# EAGLE design LAMPU_EMERGENCY_v1.1 (EAGLE 9.6.1)
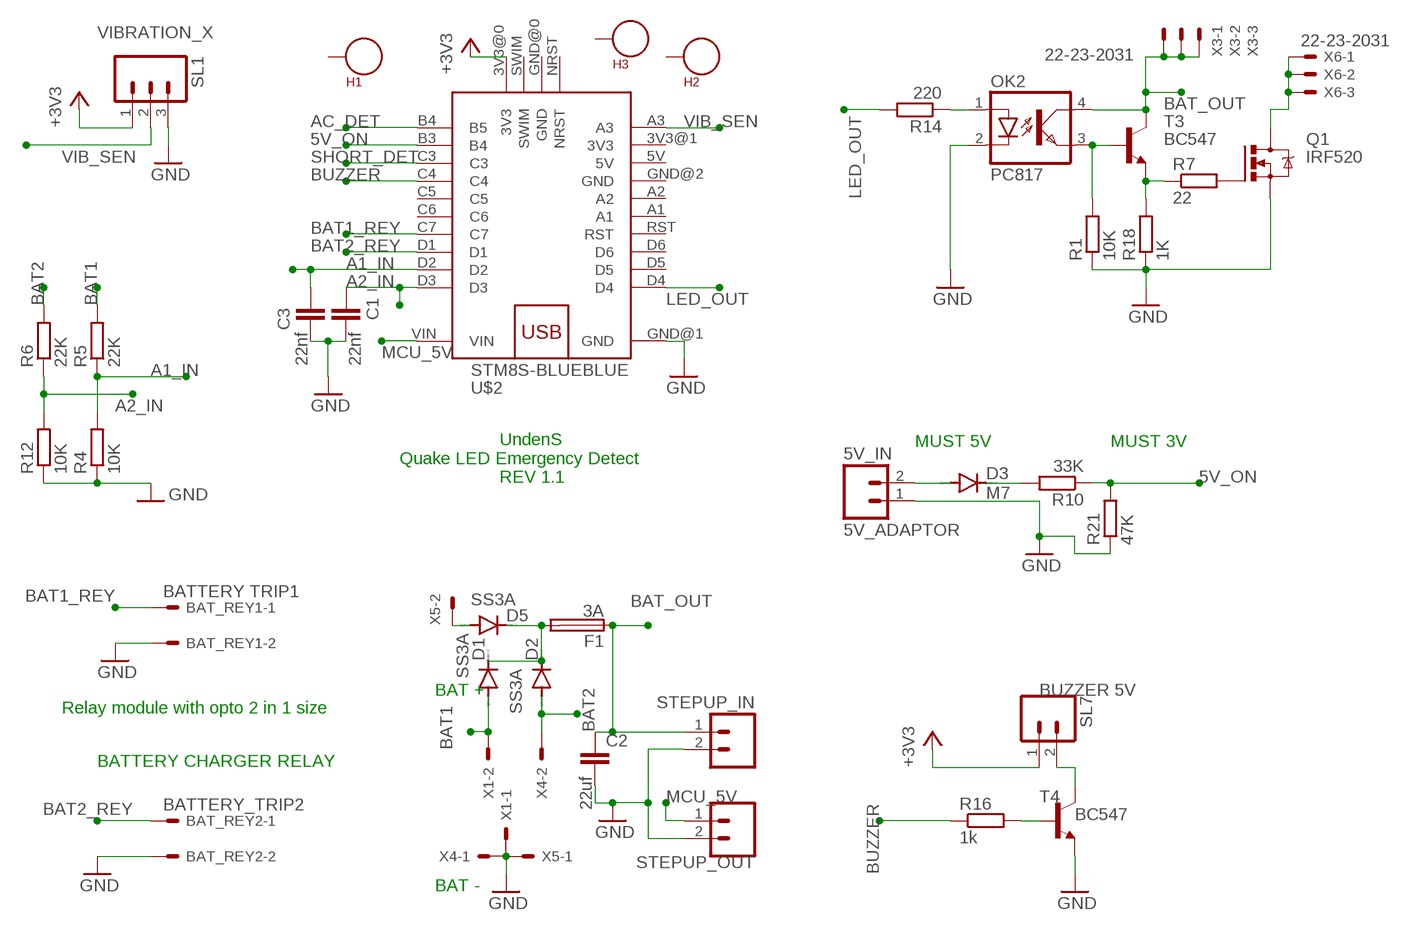
[diagram p0: schematic, sheet 1]

## Parts
5V_IN  5V_ADAPTOR  M02  [02P]
BAT_REY1  BATTERY TRIP1  22-23-2021  [22-23-2021]
BAT_REY2  BATTERY_TRIP2  22-23-2021  [22-23-2021]
C1  22nf  C-EUC0805K  [C0805K]
C2  22uf  C-EUC0805K  [C0805K]
C3  22nf  C-EUC0805K  [C0805K]
D1  SS3A  ES2D  [SMB]
D2  SS3A  ES2D  [SMB]
D3  M7  ES2D  [SMB]
D5  SS3A  ES2D  [SMB]
F1  3A  FUSEGSH15  [GSH15]
H1  SEW_HOLE  [SIMPLE_HOLE]
H2  SEW_HOLE  [SIMPLE_HOLE]
H3  SEW_HOLE  [SIMPLE_HOLE]
OK2  PC817  [DIL04]
Q1  IRF520  [TO220BV]
R1  10K  R-EU_0207/7  [0207/7]
R4  10K  R-EU_0207/7  [0207/7]
R5  22K  R-EU_0207/7  [0207/7]
R6  22K  R-EU_0207/7  [0207/7]
R7  22  R-EU_0207/7  [0207/7]
R10  33K  R-EU_0207/7  [0207/7]
R12  10K  R-EU_0207/7  [0207/7]
R14  220  R-EU_0207/7  [0207/7]
R16  1k  R-EU_0207/7  [0207/7]
R18  1K  R-EU_0207/7  [0207/7]
R21  47K  R-EU_0207/7  [0207/7]
SL1  VIBRATION_X  M03  [03P]
SL7  BUZZER 5V  M02  [02P]
STEP_IN  STEPUP_IN  M02  [02P]
STEP_MCU  STEPUP_OUT  M02  [02P]
T3  BC547  [TO92]
T4  BC547  [TO92]
U$2  STM8S-BLUEBLUE  [WEMOS-D1-MINI]
X1  22-23-2021  [22-23-2021]
X3  22-23-2031  [22-23-2031]
X4  22-23-2021  [22-23-2021]
X5  22-23-2021  [22-23-2021]
X6  22-23-2031  [22-23-2031]

## Nets
5V_ON: R10.1 R21.2 U$2.B3(B4)
+3V3: SL1.1 SL7.1 U$2.3V3@0(3V3)
A1_IN: C3.1 R4.2 R5.1 U$2.D2
A2_IN: C1.1 R6.1 R12.2 U$2.D3
AC_DET: U$2.B4(B5)
BAT1: D1.A R5.2 X1.2
BAT1_REY: BAT_REY1.1 U$2.C7
BAT2: D2.A R6.2 X4.2
BAT2_REY: BAT_REY2.1 U$2.D1
BAT_OUT: C2.1 F1.1 OK2.4(COL) STEP_IN.1 T3.3(C) X3.1 X3.2 X3.3
BUZZER: R16.1 U$2.C4
GND: 5V_IN.1 BAT_REY1.2 BAT_REY2.2 C1.2 C2.2 C3.2 OK2.2(C) Q1.S R1.1 R4.1 R12.1 R18.1 R21.1 SL1.3 STEP_IN.2 STEP_MCU.2 T4.1(E) U$2.GND@1(GND) X1.1 X4.1 X5.1
LED_OUT: R14.2 U$2.D4
MCU_5V: STEP_MCU.1 U$2.VIN
N$1: OK2.3(EMIT) R1.2 T3.2(B)
N$14: 5V_IN.2 D3.A
N$15: SL7.2 T4.3(C)
N$17: D1.C D2.C D5.C F1.2
N$18: R16.2 T4.2(B)
N$21: R7.1 R18.2 T3.1(E)
N$22: Q1.G R7.2
N$23: OK2.1(A) R14.1
N$24: Q1.D X6.1 X6.2 X6.3
N$25: D3.C R10.2
N$28: D5.A X5.2
SHORT_DET: U$2.C3
VIB_SEN: SL1.2 U$2.A3
Unconnected: H1.P$1 H2.P$1 H3.P$1 U$2.A1 U$2.A2 U$2.C5 U$2.C6 U$2.D5 U$2.D6 U$2.GND@0(GND) U$2.NRST U$2.RST U$2.SWIM

## Notes on the sheet
- MUST 5V | MUST 3V
- UndenS
  Quake LED Emergency Detect
                      REV 1.1
- BAT +
- Relay module with opto 2 in 1 size
- BATTERY CHARGER RELAY
- BAT -

## Power pins joined to a net without a drawn wire
3V3: U$2.3V3@1(3V3)
5V: U$2.5V
GND: U$2.GND@2(GND)

## Library data of the parts
5V_IN SL7 STEP_IN STEP_MCU = con-amp-quick:M02: AMP QUICK CONNECTOR; OC_FARNELL: unknown; OC_NEWARK: unknown
BAT_REY1 BAT_REY2 X1 X4 X5 = con-molex:22-23-2021: .100" (2.54mm) Center Header - 2 Pin; MF: MOLEX; MPN: 22-23-2021; OC_FARNELL: 1462926; OC_NEWARK: 25C3832
C1-C3 = rcl:C-EU: CAPACITOR, European symbol; SPICEPREFIX: C
D1-D3 D5 = diode:ES2D: DIODE super fast rectifier, 2 A
F1 = fuse:FUSE: Fuse; OC_FARNELL: unknown; OC_NEWARK: unknown
H1-H3 = LilyPad-Wearables:SEW_HOLE: Simple sew-hole .1" diameter hole with 20mil annular ring
OK2 = optocoupler:PC817: SHARP OPTO COUPLER; MPN: PC817X4J000F; OC_FARNELL: 9707727; OC_NEWARK: 97K7059; SPICEPREFIX: O
Q1 = transistor-power:IRF520: HEXFET Power MOSFET; SPICEPREFIX: Q
R1 R4-R7 R10 R12 R14 R16 R18 R21 = rcl:R-EU_: RESISTOR, European symbol; SPICEPREFIX: R
SL1 = con-amp-quick:M03: AMP QUICK CONNECTOR; OC_FARNELL: unknown; OC_NEWARK: unknown
T3 T4 = transistor:BC547: NPN TRANSISTOR; SPICEPREFIX: J
U$2 = STM8-blue:STM8S-BLUE
X3 X6 = con-molex:22-23-2031: .100" (2.54mm) Center Header - 3 Pin; MF: MOLEX; MPN: 22-23-2031; OC_FARNELL: 1462950; OC_NEWARK: 30C0862

## Board
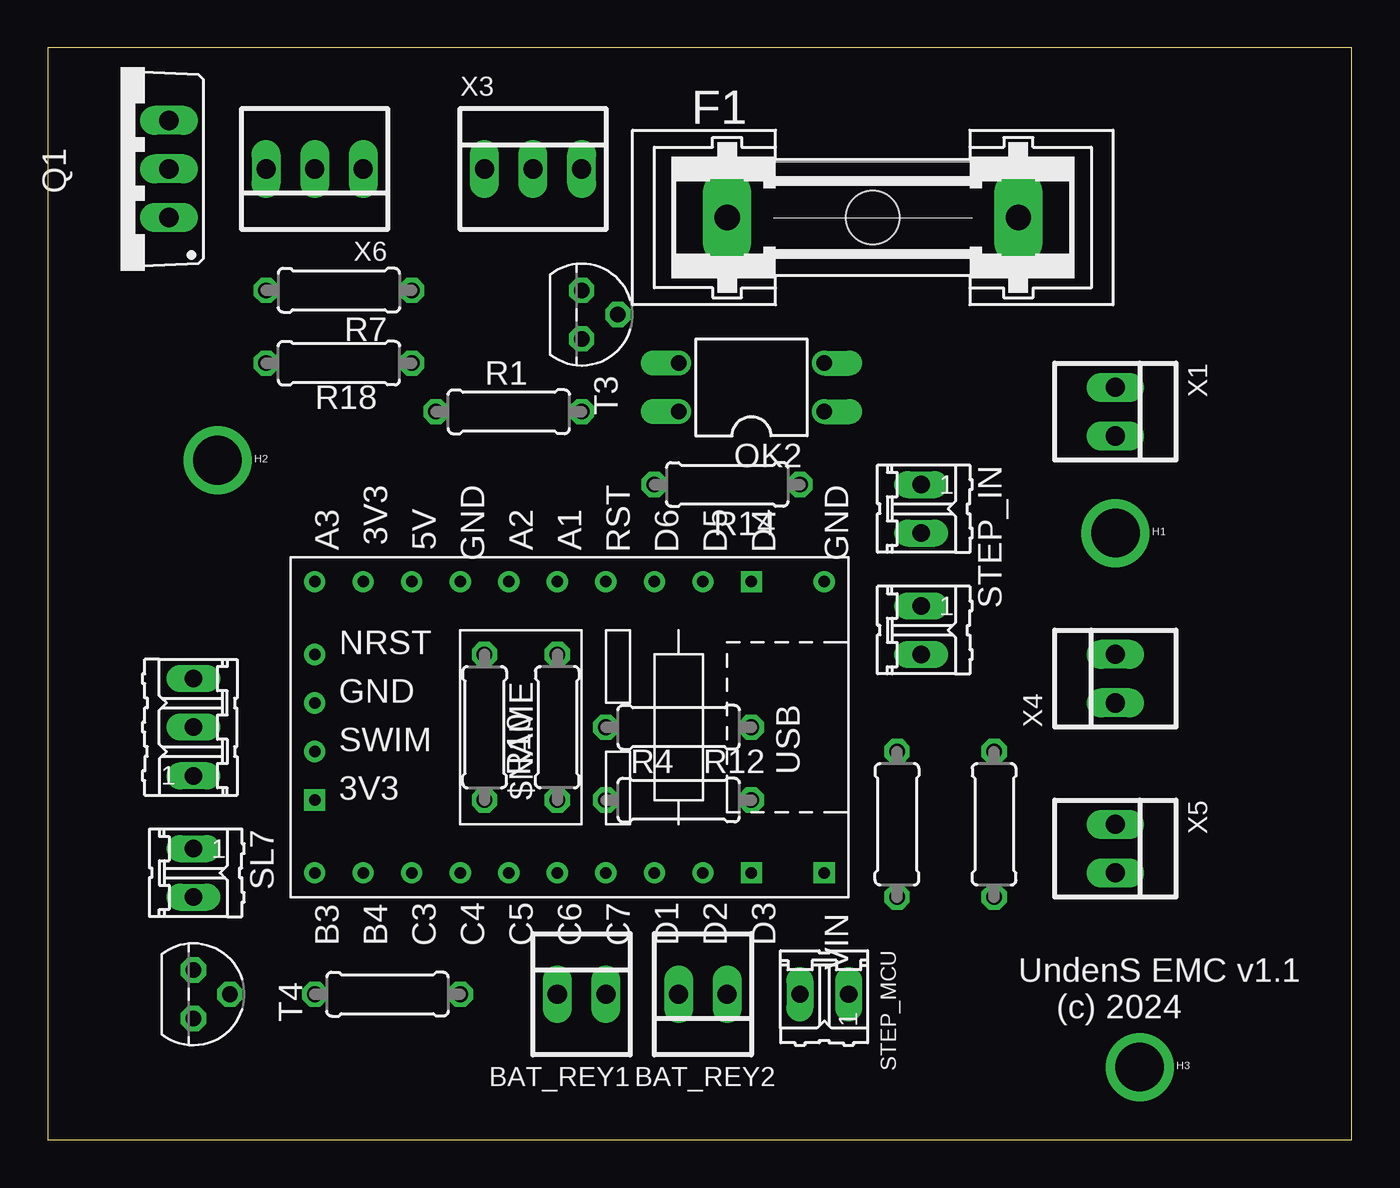
[diagram p1: board, top side]
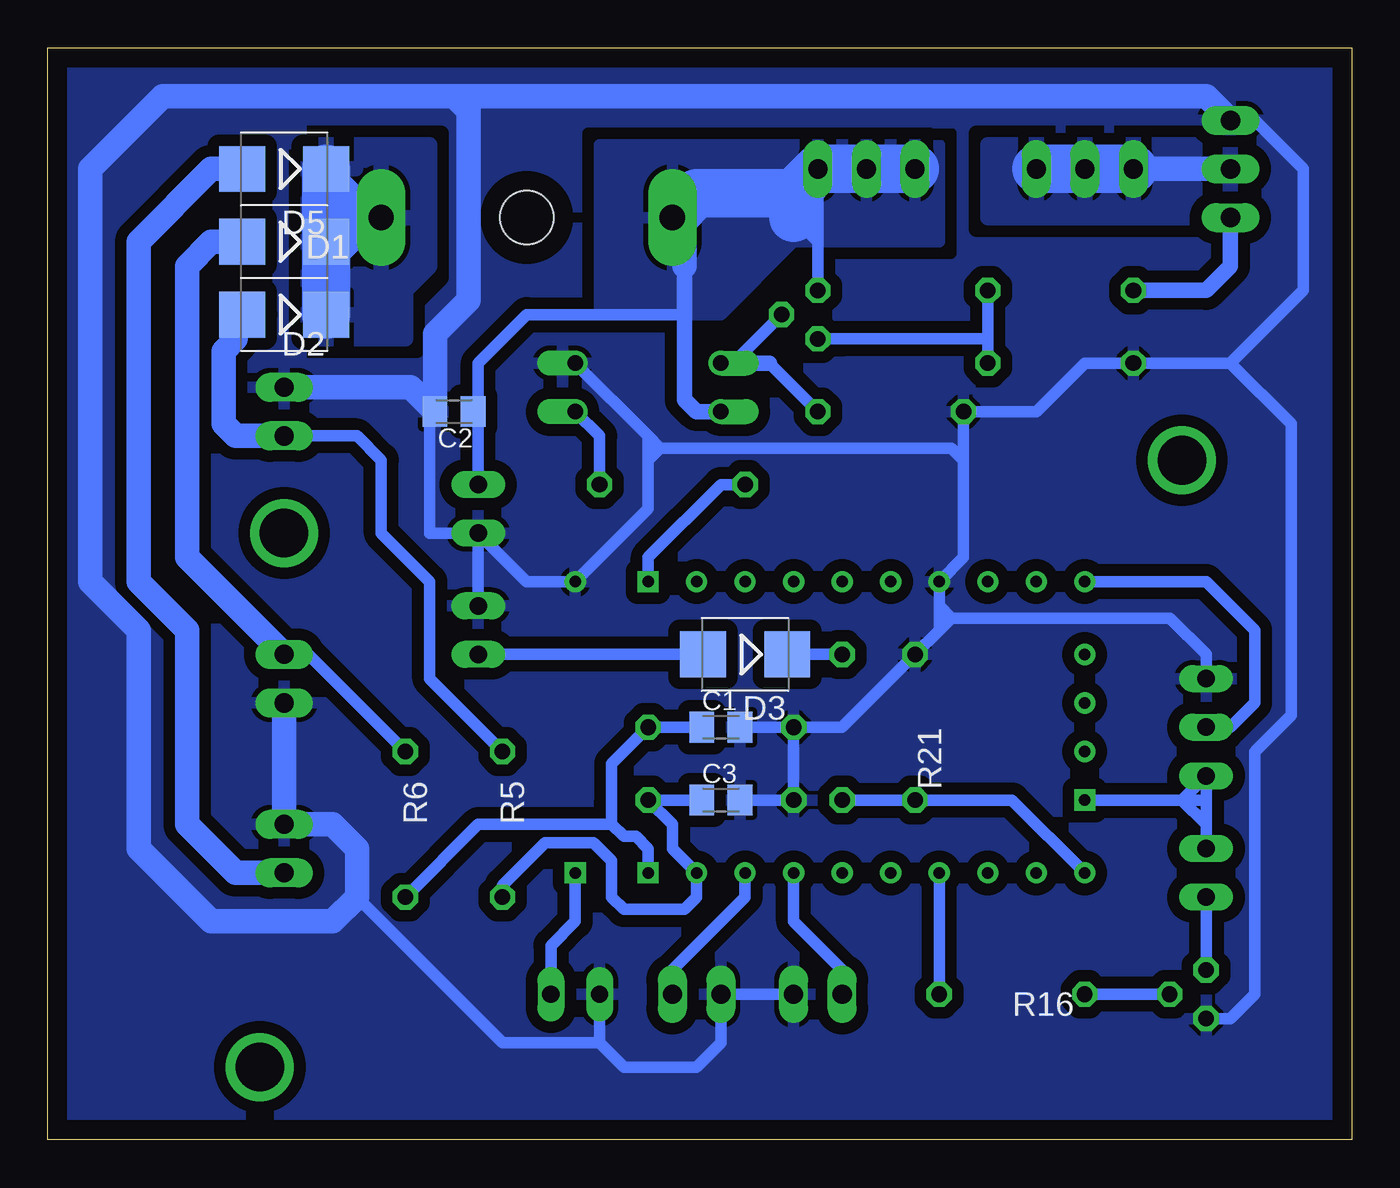
[diagram p2: board, bottom side, seen from below]

Size 68.25 x 57.14 mm. Coordinates in mm from the lower left corner, seen from the top.
Outline: 0,0 68.25,0 68.25,57.14 0,57.14 0,0
Copper layers (1*16): Top 0.035mm / dielectric 1.5mm / Bottom 0.035mm
Design rules "default": minimum track width 6mil, minimum drill 0.35mm, track to track 6mil, track to pad 6mil, pad to pad 6mil, via to via 6mil, smd to smd 6mil, copper to edge 40mil, drill to drill 6mil, minimum pad ring 10mil, minimum via ring 8mil, stop-mask expansion 4mil, vias tented up to drill 0mil, thermal gap 10mil

### Footprints (pad centres in the part's own frame; a part is rotated, then mirrored left to right if it is on the bottom)
02P = drill 0.914 long: 1 -1.27,0; 2 1.27,0
22-23-2021 = drill 1 long: 1 -1.27,0; 2 1.27,0
C0805K = smd 1.3 x 1.6: 1 -1,0; 2 1,0
SMB = smd 2.4 x 2.4: A 2.2,0; C -2.2,0
GSH15 = drill 1.321 pad 2.54 long: 1 -7.62,0; 2 7.62,0 | hole 2.794: 0,0
SIMPLE_HOLE = drill 2.54 pad 3.048: P$1 0,0
DIL04 = drill 0.813 offset: 1 -1.27,-3.81; 2 1.27,-3.81; 3 1.27,3.81; 4 -1.27,3.81
TO220BV = drill 1.016 long: D 0,-2.54; G -2.54,-2.54; S 2.54,-2.54
0207/7 = drill 0.813 octagon: 1 -3.81,0; 2 3.81,0
03P = drill 0.914 long: 1 -2.54,0; 2 0,0; 3 2.54,0
TO92 = drill 0.813 octagon: 1 1.27,0; 2 0,1.905; 3 -1.27,0
WEMOS-D1-MINI = drill 0.6 square: 3V3@0 -3.81,11.43; D3 -7.62,-11.43; D4 7.62,-11.43; VIN -7.62,-15.24 | drill 0.6: 3V3@1 7.62,8.89; 5V 7.62,6.35; A1 7.62,-1.27; A2 7.62,1.27; A3 7.62,11.43; B3 -7.62,11.43; B4 -7.62,8.89; C3 -7.62,6.35; C4 -7.62,3.81; C5 -7.62,1.27; C6 -7.62,-1.27; C7 -7.62,-3.81; D1 -7.62,-6.35; D2 -7.62,-8.89; D5 7.62,-8.89; D6 7.62,-6.35; GND@0 1.27,11.43; GND@1 7.62,3.81; GND@2 7.62,-15.24; NRST 3.81,11.43; RST 7.62,-3.81; SWIM -1.27,11.43
22-23-2031 = drill 1 long: 1 -2.54,0; 2 0,0; 3 2.54,0

### Placement (x,y rotation side)
5V_IN  45.72,26.67 270 top
BAT_REY1  27.94,7.62 0 top
BAT_REY2  34.29,7.62 180 top
C1  33.02,21.59 0 bottom
C2  46.99,38.1 180 bottom
C3  33.02,17.78 0 bottom
D1  55.88,43.18 180 bottom
D2  55.88,46.99 180 bottom
D3  31.75,25.4 180 bottom
D5  55.88,50.8 180 bottom
F1  43.18,48.26 0 top
H1  55.88,31.75 0 top
H2  8.89,35.56 0 top
H3  57.15,3.81 0 top
OK2  36.83,39.37 90 top
Q1  3.81,50.8 90 top
R1  24.13,38.1 0 top
R4  33.02,17.78 0 top
R5  44.45,16.51 90 top
R6  49.53,16.51 90 top
R7  15.24,44.45 180 top
R10  26.67,21.59 90 top
R12  33.02,21.59 0 top
R14  35.56,34.29 180 top
R16  17.78,7.62 180 top
R18  15.24,40.64 0 top
R21  22.86,21.59 270 top
SL1  7.62,21.59 90 top
SL7  7.62,13.97 270 top
STEP_IN  45.72,33.02 270 top
STEP_MCU  40.64,7.62 180 top
T3  27.94,43.18 270 top
T4  7.62,7.62 270 top
U$2  25.4,21.59 90 top
X1  55.88,38.1 270 top
X3  25.4,50.8 0 top
X4  55.88,24.13 90 top
X5  55.88,15.24 270 top
X6  13.97,50.8 180 top

### Tracks (layer width: path | path; a pad name or v marks a point on that pad's centre or on a via)
5V_ON
  Bottom 0.61: R10.1 R21.2 17.78,17.78 U$2.B3
+3V3
  Bottom 0.61: U$2.3V3@0 8.89,17.78 | 8.89,17.78 SL1.1 7.62,17.78 | 7.62,17.78 7.62,16.51 | 7.62,16.51 SL7.1 | 7.62,17.78 8.89,17.78 | 7.62,16.51 8.89,17.78
A1_IN
  Bottom 0.61: 34.29,17.51 C3.1 R4.2 35.56,16.51 35.56,15.24 U$2.D2 34.29,12.7 34.92,12.07 35.56,12.07 38.1,12.07 38.73,12.7 38.73,14.61 39.69,15.56 42.23,15.56 44.45,13.34 R5.1
A2_IN
  Bottom 0.61: C1.1 R12.2 38.73,19.68 38.73,17.78 38.73,16.51 | U$2.D3 36.83,15.24 37.47,15.88 38.1,15.88 38.73,16.51 | R6.1 45.72,16.51 38.73,16.51
BAT1
  Bottom 0.61: 58.42,43.18 D1.A | 57.15,43.18 D1.A | D1.A 58.25,43.01 | R5.2 48.26,24.13 48.26,29.21 50.8,31.75 50.8,35.56 52.07,36.83 X1.2
  Bottom 1.27: 58.59,43.01 58.25,43.01 | D1.A 58.42,42.84 58.42,41.91 59.05,41.28 59.05,37.47 58.42,36.83 X1.2
BAT1_REY
  Bottom 0.61: BAT_REY1.1 26.67,8.89 29.21,11.43 U$2.C7
BAT2
  Bottom 0.61: R6.2 54.61,25.4 X4.2
  Bottom 1.27: X4.2 60.96,30.48 60.96,45.72 59.69,46.99 D2.A
BAT2_REY
  Bottom 0.61: BAT_REY2.1 35.56,8.89 31.75,12.7 U$2.D1
BAT_OUT
  Bottom 0.61: 29.21,48.26 27.94,46.99 T3.3 27.94,49.53 | 45.72,37.83 45.72,40.64 43.18,43.18 34.92,43.18 | STEP_IN.1 45.72,37.83 | 45.72,37.83 C2.1
  Bottom 0.813: OK2.4 34.29,38.1 34.92,38.73 34.92,43.18 34.92,45.72 | 27.94,49.53 X3.3
  Bottom 1.27: 34.92,45.72 34.92,47.62 F1.1
  Bottom 2.54: X3.3 29.21,49.53 | 29.21,48.26 29.21,49.53 | 29.21,49.53 34.29,49.53 F1.1 | X3.1 X3.3 | X3.2 X3.3
  pour Bottom: 21.59,52.07 21.59,46.99 29.21,46.99 33.02,43.18 39.37,43.18 39.37,52.07
BUZZER
  Bottom 0.61: R16.1 U$2.C4
GND
  Bottom 0.61: Q1.S 5.08,53.34 2.54,50.8 2.54,44.45 6.35,40.64 | C2.2 48.26,38.1 48.26,31.75 STEP_IN.2 | BAT_REY1.2 BAT_REY2.2 33.02,5.08 34.29,3.81 38.1,3.81 39.37,5.08 | 39.37,5.08 STEP_MCU.2 | R12.1 R4.1 C3.2 | R12.1 26.67,21.59 R21.1 21.59,26.67 | 21.59,26.67 21.59,27.94 | 21.59,27.94 U$2.GND@1 20.32,30.48 20.32,35.56 | SL1.3 7.62,25.4 9.52,27.31 20.95,27.31 | 20.95,27.31 21.59,26.67 | 20.95,27.31 21.59,27.94 | T4.1 6.35,6.35 5.08,7.62 5.08,20.32 3.17,22.22 3.17,37.47 6.35,40.64 | STEP_IN.2 43.18,29.21 U$2.GND@2 36.83,33.02 36.83,35.56 | STEP_IN.2 5V_IN.1 | OK2.2 36.83,36.83 | 36.83,36.83 36.83,35.56 | 20.32,35.56 R1.1 16.51,38.1 13.97,40.64 R18.1 6.35,40.64 | 36.83,36.83 36.2,36.2 | 36.2,36.2 36.83,35.56 | 39.37,5.08 44.45,5.08 52.07,12.7 | R12.1 C1.2 | 36.2,36.2 20.95,36.2 20.32,35.56
  Bottom 1.016: Q1.S 7.36,54.35
  Bottom 1.27: Q1.S 7.62,54.61 46.99,54.61 | 46.99,54.61 62.23,54.61 66.04,50.8 66.04,29.21 63.5,26.67 63.5,15.24 59.69,11.43 53.34,11.43 52.07,12.7 52.07,15.24 53.34,16.51 X5.1 X4.1 | X1.1 49.26,39.37 C2.2 47.99,42.18 46.23,43.94 46.23,53.85 46.99,54.61
  pour Bottom (isolate 0.61, rank 6): -2.54,59.69 -2.54,-2.54 69.85,-2.54 69.85,59.69
LED_OUT
  Bottom 0.61: U$2.D4 36.83,30.48 33.02,34.29 R14.2
MCU_5V
  Bottom 0.61: STEP_MCU.1 41.91,10.16 40.64,11.43 U$2.VIN
N$1
  Bottom 0.61: OK2.3 32.38,40.64 T3.2 | R1.2 30.48,40.64
  Bottom 0.813: 30.48,40.64 OK2.3
N$14
  Bottom 0.61: D3.A 5V_IN.2
N$15
  Bottom 0.61: SL7.2 T4.3
N$17
  Bottom 2.54: D2.C D5.C 53.68,49.87 52.07,48.26 | D1.C 53.68,46.65 52.07,48.26 | 52.07,48.26 F1.2
  pour Bottom: 49.53,52.07 54.61,52.07 54.61,41.91 49.53,41.91 49.53,44.45 48.26,45.72 48.26,52.07
N$18
  Bottom 0.61: T4.2 R16.2
N$21
  Bottom 0.61: 26.67,41.91 T3.1 19.05,41.91 | R18.2 19.05,41.91 | 19.05,41.91 R7.1
N$22
  Bottom 0.813: Q1.G 6.35,45.72 7.62,44.45 R7.2
N$23
  Bottom 0.61: R14.1 39.37,36.83 OK2.1
N$24
  Bottom 1.27: Q1.D X6.3
  Bottom 2.54: X6.1 X6.2 X6.3
  pour Bottom (isolate 0.61): 6.35,52.07 6.35,49.53 7.62,48.26 19.05,48.26 19.05,52.07
N$25
  Bottom 0.61: R10.2 D3.C
N$28
  Bottom 1.27: X5.2 58.42,13.97 60.96,16.51 60.96,26.67 63.5,29.21 63.5,46.99 59.69,50.8 D5.A
VIB_SEN
  Bottom 0.61: SL1.2 6.35,21.59 5.08,22.86 5.08,26.67 7.62,29.21 U$2.A3

### Text on the board
tNames: UndenS EMC v1.1 / (c) 2024